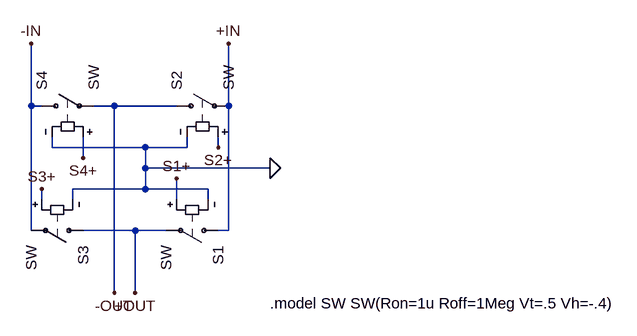
[diagram p0: schematic H-Bridge.asc]
H-Bridge.asc, the LTspice schematic file:
Version 4
SHEET 1 1012 680
WIRE 64 128 64 32
WIRE 80 128 64 128
WIRE 192 128 160 128
WIRE 288 128 192 128
WIRE 368 128 368 32
WIRE 96 192 96 176
WIRE 240 192 96 192
WIRE 304 192 304 176
WIRE 304 192 240 192
WIRE 352 192 352 176
WIRE 144 208 144 176
WIRE 240 224 240 192
WIRE 432 224 240 224
WIRE 240 256 240 224
WIRE 240 256 128 256
WIRE 336 256 240 256
WIRE 80 272 80 256
WIRE 128 272 128 256
WIRE 288 272 288 240
WIRE 336 272 336 256
WIRE 64 320 64 128
WIRE 224 320 144 320
WIRE 272 320 224 320
WIRE 368 320 368 128
WIRE 368 320 352 320
WIRE 192 416 192 128
WIRE 224 416 224 320
FLAG 224 416 +OUT
FLAG 192 416 -OUT
FLAG 64 32 -IN
FLAG 368 32 +IN
FLAG 432 224 0
FLAG 144 208 S4+
FLAG 80 256 S3+
FLAG 352 192 S2+
FLAG 288 240 S1+
SYMBOL sw 64 128 R270
SYMATTR InstName S4
SYMBOL sw 272 128 R270
SYMATTR InstName S2
SYMBOL sw 160 320 R90
SYMATTR InstName S3
SYMBOL sw 368 320 R90
SYMATTR InstName S1
TEXT 432 432 Left 2 !.model SW SW(Ron=1u Roff=1Meg Vt=.5 Vh=-.4)

The netlist it stands for:
* H-Bridge.asc
S4 -IN -OUT S4+ 0 SW
S2 -OUT +IN S2+ 0 SW
S3 +OUT -IN S3+ 0 SW
S1 +IN +OUT S1+ 0 SW
.model SW SW(Ron=1u Roff=1Meg Vt=.5 Vh=-.4)
.backanno
.end